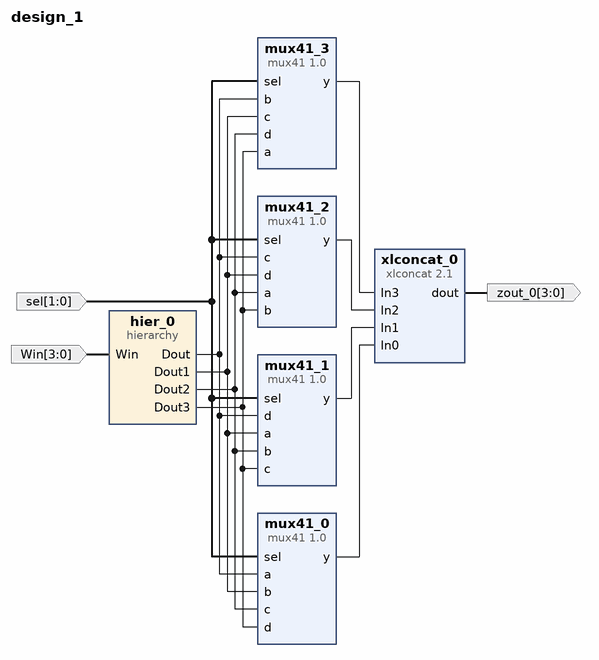
[diagram p0: block diagram of the top level]
# Vivado block design design_1, xc7a200tfbg676-2, Vivado 2023.2
create_bd_design design_1

create_bd_port -dir I -from 1 -to 0 sel
create_bd_port -dir I -from 3 -to 0 Win
create_bd_port -dir O -from 3 -to 0 zout_0

create_bd_cell -type ip -vlnv xilinx.com:user:mux41:1.0 mux41_0
create_bd_cell -type ip -vlnv xilinx.com:user:mux41:1.0 mux41_1
create_bd_cell -type ip -vlnv xilinx.com:user:mux41:1.0 mux41_2
create_bd_cell -type ip -vlnv xilinx.com:user:mux41:1.0 mux41_3
create_bd_cell -type ip -vlnv xilinx.com:ip:xlconcat:2.1 xlconcat_0
set_property -dict {CONFIG.NUM_PORTS 4} [get_bd_cells xlconcat_0]
create_bd_cell -type hier hier_0

# ---- hierarchy /hier_0 ----
current_bd_instance /hier_0
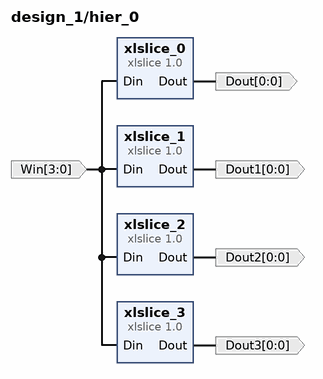
[diagram p1: block diagram inside /hier_0]
create_bd_pin -dir I -from 3 -to 0 Win
create_bd_pin -dir O -from 0 -to 0 Dout
create_bd_pin -dir O -from 0 -to 0 Dout1
create_bd_pin -dir O -from 0 -to 0 Dout2
create_bd_pin -dir O -from 0 -to 0 Dout3

create_bd_cell -type ip -vlnv xilinx.com:ip:xlslice:1.0 xlslice_0
set_property -dict {CONFIG.DIN_WIDTH 4} [get_bd_cells xlslice_0]
create_bd_cell -type ip -vlnv xilinx.com:ip:xlslice:1.0 xlslice_1
set_property -dict {CONFIG.DIN_FROM 1 CONFIG.DIN_TO 1 CONFIG.DIN_WIDTH 4} [get_bd_cells xlslice_1]
create_bd_cell -type ip -vlnv xilinx.com:ip:xlslice:1.0 xlslice_2
set_property -dict {CONFIG.DIN_TO 2 CONFIG.DIN_WIDTH 4} [get_bd_cells xlslice_2]
create_bd_cell -type ip -vlnv xilinx.com:ip:xlslice:1.0 xlslice_3
set_property -dict {CONFIG.DIN_FROM 3 CONFIG.DIN_TO 3 CONFIG.DIN_WIDTH 4} [get_bd_cells xlslice_3]

# ---- connections ----

current_bd_instance /hier_0
connect_bd_net [get_bd_pins Win] [get_bd_pins xlslice_1/Din] [get_bd_pins xlslice_2/Din] [get_bd_pins xlslice_3/Din] [get_bd_pins xlslice_0/Din]
connect_bd_net [get_bd_pins xlslice_0/Dout] [get_bd_pins Dout]
connect_bd_net [get_bd_pins xlslice_1/Dout] [get_bd_pins Dout1]
connect_bd_net [get_bd_pins xlslice_2/Dout] [get_bd_pins Dout2]
connect_bd_net [get_bd_pins xlslice_3/Dout] [get_bd_pins Dout3]

current_bd_instance /
connect_bd_net [get_bd_ports Win] [get_bd_pins hier_0/Win]
connect_bd_net [get_bd_pins mux41_0/y] [get_bd_pins xlconcat_0/In0]
connect_bd_net [get_bd_pins mux41_1/y] [get_bd_pins xlconcat_0/In1]
connect_bd_net [get_bd_pins mux41_2/y] [get_bd_pins xlconcat_0/In2]
connect_bd_net [get_bd_pins mux41_3/y] [get_bd_pins xlconcat_0/In3]
connect_bd_net [get_bd_ports sel] [get_bd_pins mux41_0/sel] [get_bd_pins mux41_1/sel] [get_bd_pins mux41_2/sel] [get_bd_pins mux41_3/sel]
connect_bd_net [get_bd_pins xlconcat_0/dout] [get_bd_ports zout_0]
connect_bd_net -net xlslice_0_Dout [get_bd_pins hier_0/Dout] \
  [get_bd_pins mux41_0/a] [get_bd_pins mux41_1/d] [get_bd_pins mux41_2/c] [get_bd_pins mux41_3/b]
connect_bd_net -net xlslice_1_Dout [get_bd_pins hier_0/Dout1] \
  [get_bd_pins mux41_1/a] [get_bd_pins mux41_0/b] [get_bd_pins mux41_2/d] [get_bd_pins mux41_3/c]
connect_bd_net -net xlslice_2_Dout [get_bd_pins hier_0/Dout2] \
  [get_bd_pins mux41_2/a] [get_bd_pins mux41_3/d] [get_bd_pins mux41_1/b] [get_bd_pins mux41_0/c]
connect_bd_net -net xlslice_3_Dout [get_bd_pins hier_0/Dout3] \
  [get_bd_pins mux41_3/a] [get_bd_pins mux41_2/b] [get_bd_pins mux41_1/c] [get_bd_pins mux41_0/d]

validate_bd_design
save_bd_design
